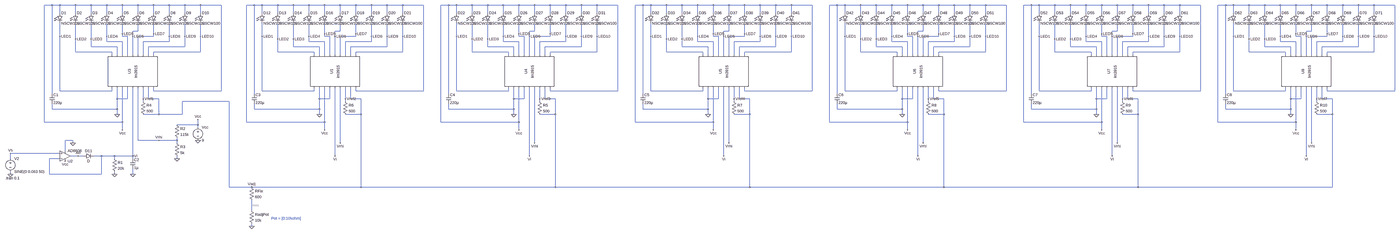
[diagram p0: schematic LM3915_Chain.asc, whole sheet]
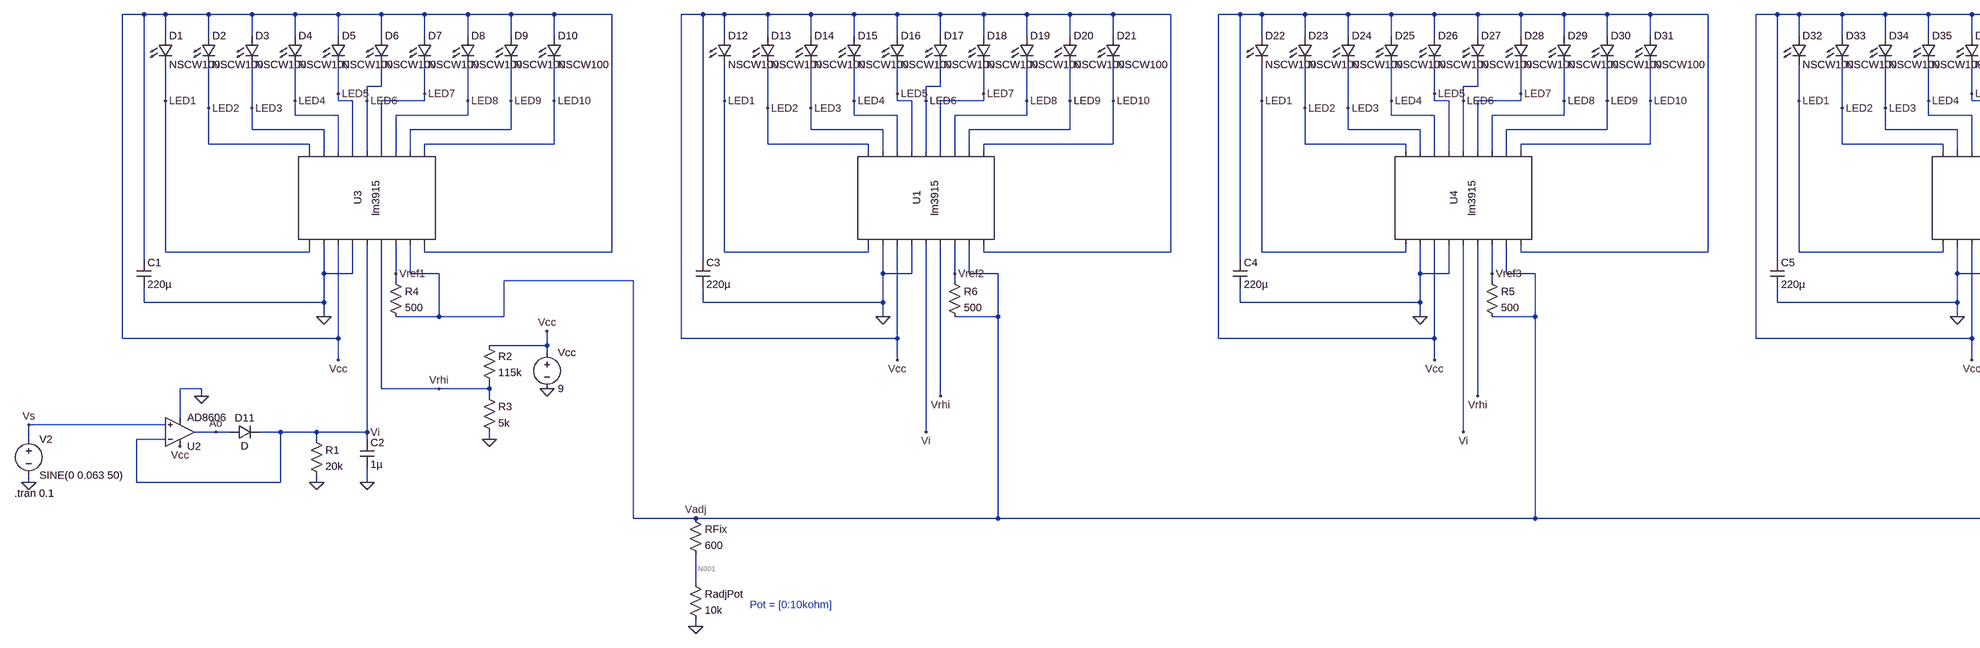
[diagram p1: schematic LM3915_Chain.asc, part, row 1 of 1, column 1 of 2]
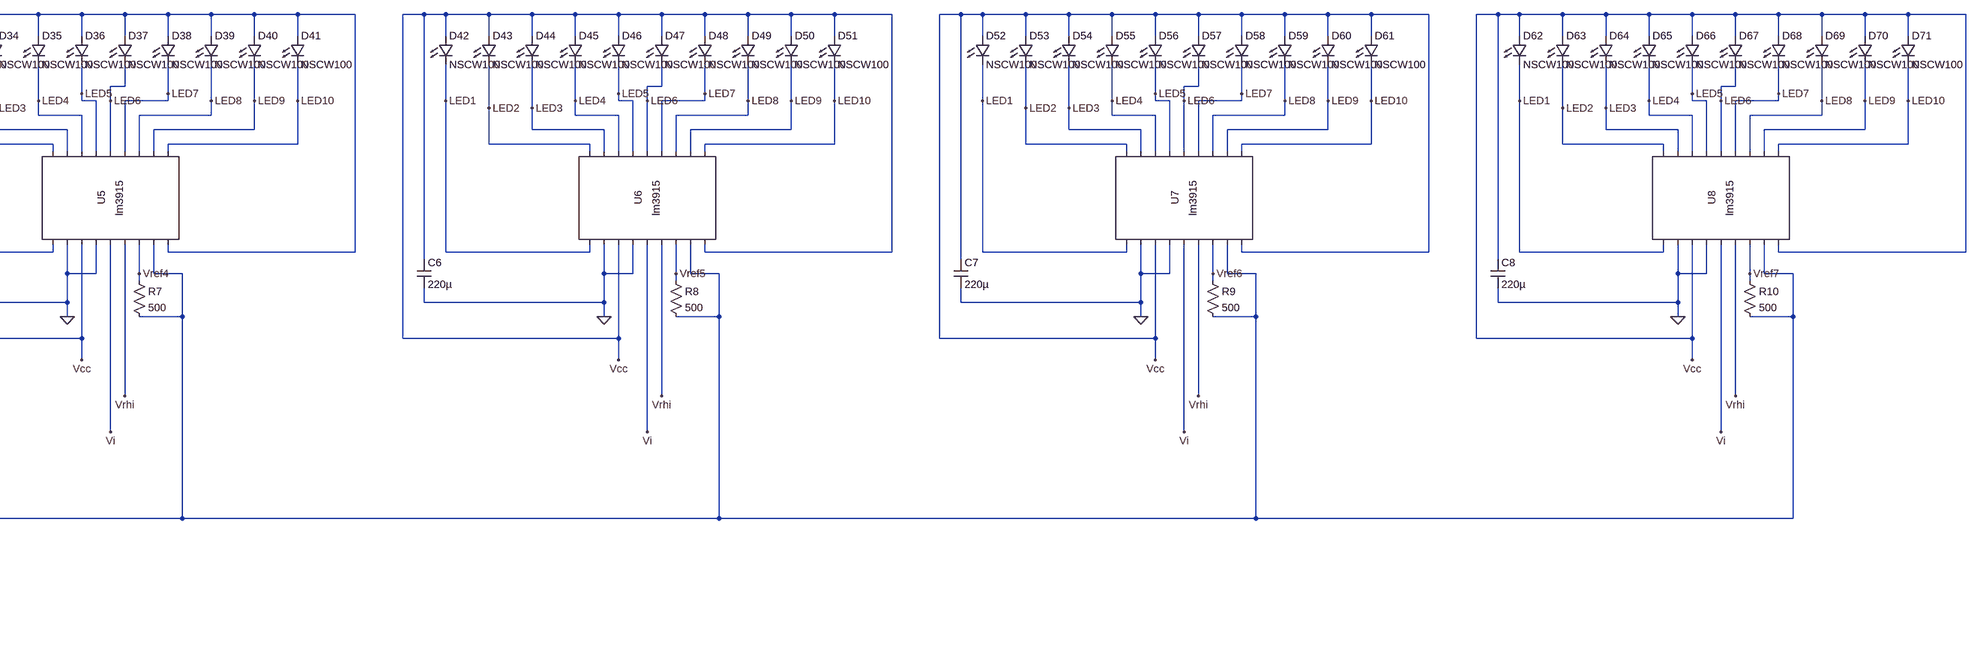
[diagram p2: schematic LM3915_Chain.asc, part, row 1 of 1, column 2 of 2]
* LM3915_Chain.asc
D1 Vcc LED1 NSCW100
D2 Vcc LED2 NSCW100
D3 Vcc LED3 NSCW100
D4 Vcc LED4 NSCW100
D5 Vcc LED5 NSCW100
D6 Vcc LED6 NSCW100
D7 Vcc LED7 NSCW100
D8 Vcc LED8 NSCW100
D9 Vcc LED9 NSCW100
D10 Vcc LED10 NSCW100
C1 Vcc 0 220µ
Vcc Vcc 0 9
V2 Vs 0 SINE(0 0.063 50)
R1 Vi 0 20k
D11 Ao Vi D
XU2 Vs Vi Vcc 0 Ao AD8606  ; pins In+ In- V+ V- OUT
C2 Vi 0 1µ
* U3: lm3915 (symbol AutoGenerated\lm3915 not available, pins judged from their places): pin1=LED1 pin2=0 pin3=Vcc pin4=0 pin5=Vi pin6=Vrhi pin7=Vref1 pin8=Vadj pin9=Vcc pin10=LED2 pin11=LED3 pin12=LED4 pin13=LED5 pin14=LED6 pin15=LED7 pin16=LED8 pin17=LED9 pin18=LED10
R2 Vcc Vrhi 115k
R3 Vrhi 0 5k
R4 Vref1 Vadj 500
D12 Vcc LED1 NSCW100
D13 Vcc LED2 NSCW100
D14 Vcc LED3 NSCW100
D15 Vcc LED4 NSCW100
D16 Vcc LED5 NSCW100
D17 Vcc LED6 NSCW100
D18 Vcc LED7 NSCW100
D19 Vcc LED8 NSCW100
D20 Vcc LED9 NSCW100
D21 Vcc LED10 NSCW100
C3 Vcc 0 220µ
* U1: lm3915 (symbol AutoGenerated\lm3915 not available, pins judged from their places): pin1=LED1 pin2=0 pin3=Vcc pin4=0 pin5=Vi pin6=Vrhi pin7=Vref2 pin8=Vadj pin9=Vcc pin10=LED2 pin11=LED3 pin12=LED4 pin13=LED5 pin14=LED6 pin15=LED7 pin16=LED8 pin17=LED9 pin18=LED10
R6 Vref2 Vadj 500
RFix Vadj N001 600
D22 Vcc LED1 NSCW100
D23 Vcc LED2 NSCW100
D24 Vcc LED3 NSCW100
D25 Vcc LED4 NSCW100
D26 Vcc LED5 NSCW100
D27 Vcc LED6 NSCW100
D28 Vcc LED7 NSCW100
D29 Vcc LED8 NSCW100
D30 Vcc LED9 NSCW100
D31 Vcc LED10 NSCW100
C4 Vcc 0 220µ
* U4: lm3915 (symbol AutoGenerated\lm3915 not available, pins judged from their places): pin1=LED1 pin2=0 pin3=Vcc pin4=0 pin5=Vi pin6=Vrhi pin7=Vref3 pin8=Vadj pin9=Vcc pin10=LED2 pin11=LED3 pin12=LED4 pin13=LED5 pin14=LED6 pin15=LED7 pin16=LED8 pin17=LED9 pin18=LED10
R5 Vref3 Vadj 500
D32 Vcc LED1 NSCW100
D33 Vcc LED2 NSCW100
D34 Vcc LED3 NSCW100
D35 Vcc LED4 NSCW100
D36 Vcc LED5 NSCW100
D37 Vcc LED6 NSCW100
D38 Vcc LED7 NSCW100
D39 Vcc LED8 NSCW100
D40 Vcc LED9 NSCW100
D41 Vcc LED10 NSCW100
C5 Vcc 0 220µ
* U5: lm3915 (symbol AutoGenerated\lm3915 not available, pins judged from their places): pin1=LED1 pin2=0 pin3=Vcc pin4=0 pin5=Vi pin6=Vrhi pin7=Vref4 pin8=Vadj pin9=Vcc pin10=LED2 pin11=LED3 pin12=LED4 pin13=LED5 pin14=LED6 pin15=LED7 pin16=LED8 pin17=LED9 pin18=LED10
R7 Vref4 Vadj 500
D42 Vcc LED1 NSCW100
D43 Vcc LED2 NSCW100
D44 Vcc LED3 NSCW100
D45 Vcc LED4 NSCW100
D46 Vcc LED5 NSCW100
D47 Vcc LED6 NSCW100
D48 Vcc LED7 NSCW100
D49 Vcc LED8 NSCW100
D50 Vcc LED9 NSCW100
D51 Vcc LED10 NSCW100
C6 Vcc 0 220µ
* U6: lm3915 (symbol AutoGenerated\lm3915 not available, pins judged from their places): pin1=LED1 pin2=0 pin3=Vcc pin4=0 pin5=Vi pin6=Vrhi pin7=Vref5 pin8=Vadj pin9=Vcc pin10=LED2 pin11=LED3 pin12=LED4 pin13=LED5 pin14=LED6 pin15=LED7 pin16=LED8 pin17=LED9 pin18=LED10
R8 Vref5 Vadj 500
D52 Vcc LED1 NSCW100
D53 Vcc LED2 NSCW100
D54 Vcc LED3 NSCW100
D55 Vcc LED4 NSCW100
D56 Vcc LED5 NSCW100
D57 Vcc LED6 NSCW100
D58 Vcc LED7 NSCW100
D59 Vcc LED8 NSCW100
D60 Vcc LED9 NSCW100
D61 Vcc LED10 NSCW100
C7 Vcc 0 220µ
* U7: lm3915 (symbol AutoGenerated\lm3915 not available, pins judged from their places): pin1=LED1 pin2=0 pin3=Vcc pin4=0 pin5=Vi pin6=Vrhi pin7=Vref6 pin8=Vadj pin9=Vcc pin10=LED2 pin11=LED3 pin12=LED4 pin13=LED5 pin14=LED6 pin15=LED7 pin16=LED8 pin17=LED9 pin18=LED10
R9 Vref6 Vadj 500
D62 Vcc LED1 NSCW100
D63 Vcc LED2 NSCW100
D64 Vcc LED3 NSCW100
D65 Vcc LED4 NSCW100
D66 Vcc LED5 NSCW100
D67 Vcc LED6 NSCW100
D68 Vcc LED7 NSCW100
D69 Vcc LED8 NSCW100
D70 Vcc LED9 NSCW100
D71 Vcc LED10 NSCW100
C8 Vcc 0 220µ
* U8: lm3915 (symbol AutoGenerated\lm3915 not available, pins judged from their places): pin1=LED1 pin2=0 pin3=Vcc pin4=0 pin5=Vi pin6=Vrhi pin7=Vref7 pin8=Vadj pin9=Vcc pin10=LED2 pin11=LED3 pin12=LED4 pin13=LED5 pin14=LED6 pin15=LED7 pin16=LED8 pin17=LED9 pin18=LED10
R10 Vref7 Vadj 500
RadjPot N001 0 10k
.model D D
.lib standard.dio
.tran 0.1
* Pot = [0:10kohm]
.lib ADI.lib
.backanno
.end

* Results of the author's LTspice run, read from the files saved beside the schematic
* Operating Point, zero values left out:
*   V(vcc) = 9 V
*   V(led1) = 7.98 V
*   V(led2) = 7.98 V
*   V(led3) = 7.98 V
*   V(led4) = 7.98 V
*   V(led5) = 7.98 V
*   V(led6) = 7.98 V
*   V(led7) = 7.98 V
*   V(led8) = 7.98 V
*   V(led9) = 7.98 V
*   V(led10) = 7.98 V
*   V(vi) = -195 µV
*   V(ao) = 429.7 mV
*   V(vadj) = 8.677 V
*   V(vref1) = 8.698 V
*   V(vrhi) = 170.6 mV
*   V(vref2) = 8.698 V
*   V(n001) = 8.186 V
*   V(vref3) = 8.698 V
*   V(vref4) = 8.698 V
*   V(vref5) = 8.698 V
*   V(vref6) = 8.698 V
*   V(vref7) = 8.698 V
*   I(D11) = 165.2 nA
*   I(D71) = 1 µA
*   I(D70) = 1 µA
*   I(D69) = 1 µA
*   I(D68) = 1 µA
*   I(D67) = 1 µA
*   I(D66) = 1 µA
*   I(D65) = 1 µA
*   I(D64) = 1 µA
*   I(D63) = 1 µA
*   I(D62) = 1 µA
*   I(D61) = 1 µA
*   I(D60) = 1 µA
*   I(D59) = 1 µA
*   I(D58) = 1 µA
*   I(D57) = 1 µA
*   I(D56) = 1 µA
*   I(D55) = 1 µA
*   I(D54) = 1 µA
*   I(D53) = 1 µA
*   I(D52) = 1 µA
*   I(D51) = 1 µA
*   I(D50) = 1 µA
*   I(D49) = 1 µA
*   I(D48) = 1 µA
*   I(D47) = 1 µA
*   I(D46) = 1 µA
*   I(D45) = 1 µA
*   I(D44) = 1 µA
*   I(D43) = 1 µA
*   I(D42) = 1 µA
*   I(D41) = 1 µA
*   I(D40) = 1 µA
*   I(D39) = 1 µA
*   I(D38) = 1 µA
*   I(D37) = 1 µA
*   I(D36) = 1 µA
*   I(D35) = 1 µA
*   I(D34) = 1 µA
*   I(D33) = 1 µA
*   I(D32) = 1 µA
*   I(D31) = 1 µA
*   I(D30) = 1 µA
*   I(D29) = 1 µA
*   I(D28) = 1 µA
*   I(D27) = 1 µA
*   I(D26) = 1 µA
*   I(D25) = 1 µA
*   I(D24) = 1 µA
*   I(D23) = 1 µA
*   I(D22) = 1 µA
*   I(D21) = 1 µA
*   I(D20) = 1 µA
*   I(D19) = 1 µA
*   I(D18) = 1 µA
*   I(D17) = 1 µA
*   I(D16) = 1 µA
*   I(D15) = 1 µA
*   I(D14) = 1 µA
*   I(D13) = 1 µA
*   I(D12) = 1 µA
*   I(D10) = 1 µA
*   I(D9) = 1 µA
*   I(D8) = 1 µA
*   I(D7) = 1 µA
*   I(D6) = 1 µA
*   I(D5) = 1 µA
*   I(D4) = 1 µA
*   I(D3) = 1 µA
*   I(D2) = 1 µA
*   I(D1) = 1 µA
*   I(Radjpot) = 818.6 µA
*   I(R10) = 41.94 µA
*   I(R9) = 41.94 µA
*   I(R8) = 41.94 µA
*   I(R7) = 41.94 µA
*   I(R5) = 41.94 µA
*   I(Rfix) = 818.6 µA
*   I(R6) = 41.94 µA
*   I(R4) = 41.94 µA
*   I(R3) = 34.13 µA
*   I(R2) = 76.78 µA
*   I(R1) = -9.751 nA
*   I(Vcc) = -25.94 mA
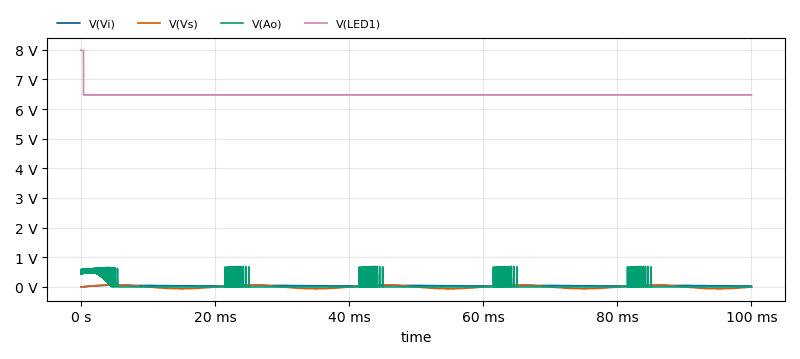
[diagram p3: Transient Analysis of LM3915_Chain.asc, plotted from the saved traces]
* Transient Analysis, 1 run:
*   V(Vi): min -195 µV, max 63.72 mV, average 43.65 mV, rms 45.2 mV, last 28.29 mV
*   V(Vs): min -62.9 mV, max 63 mV, average 410.6 µV, rms 44.11 mV, last 0 V
*   V(Ao): min -98.78 µV, max 693.8 mV, average 30.28 mV, rms 124.9 mV, last 0 V
*   V(LED1): min 6.476 V, max 7.98 V, average 6.482 V, rms 6.483 V, last 6.476 V